# EAGLE design SolarPanelOptimizer (EAGLE 9.6.2)
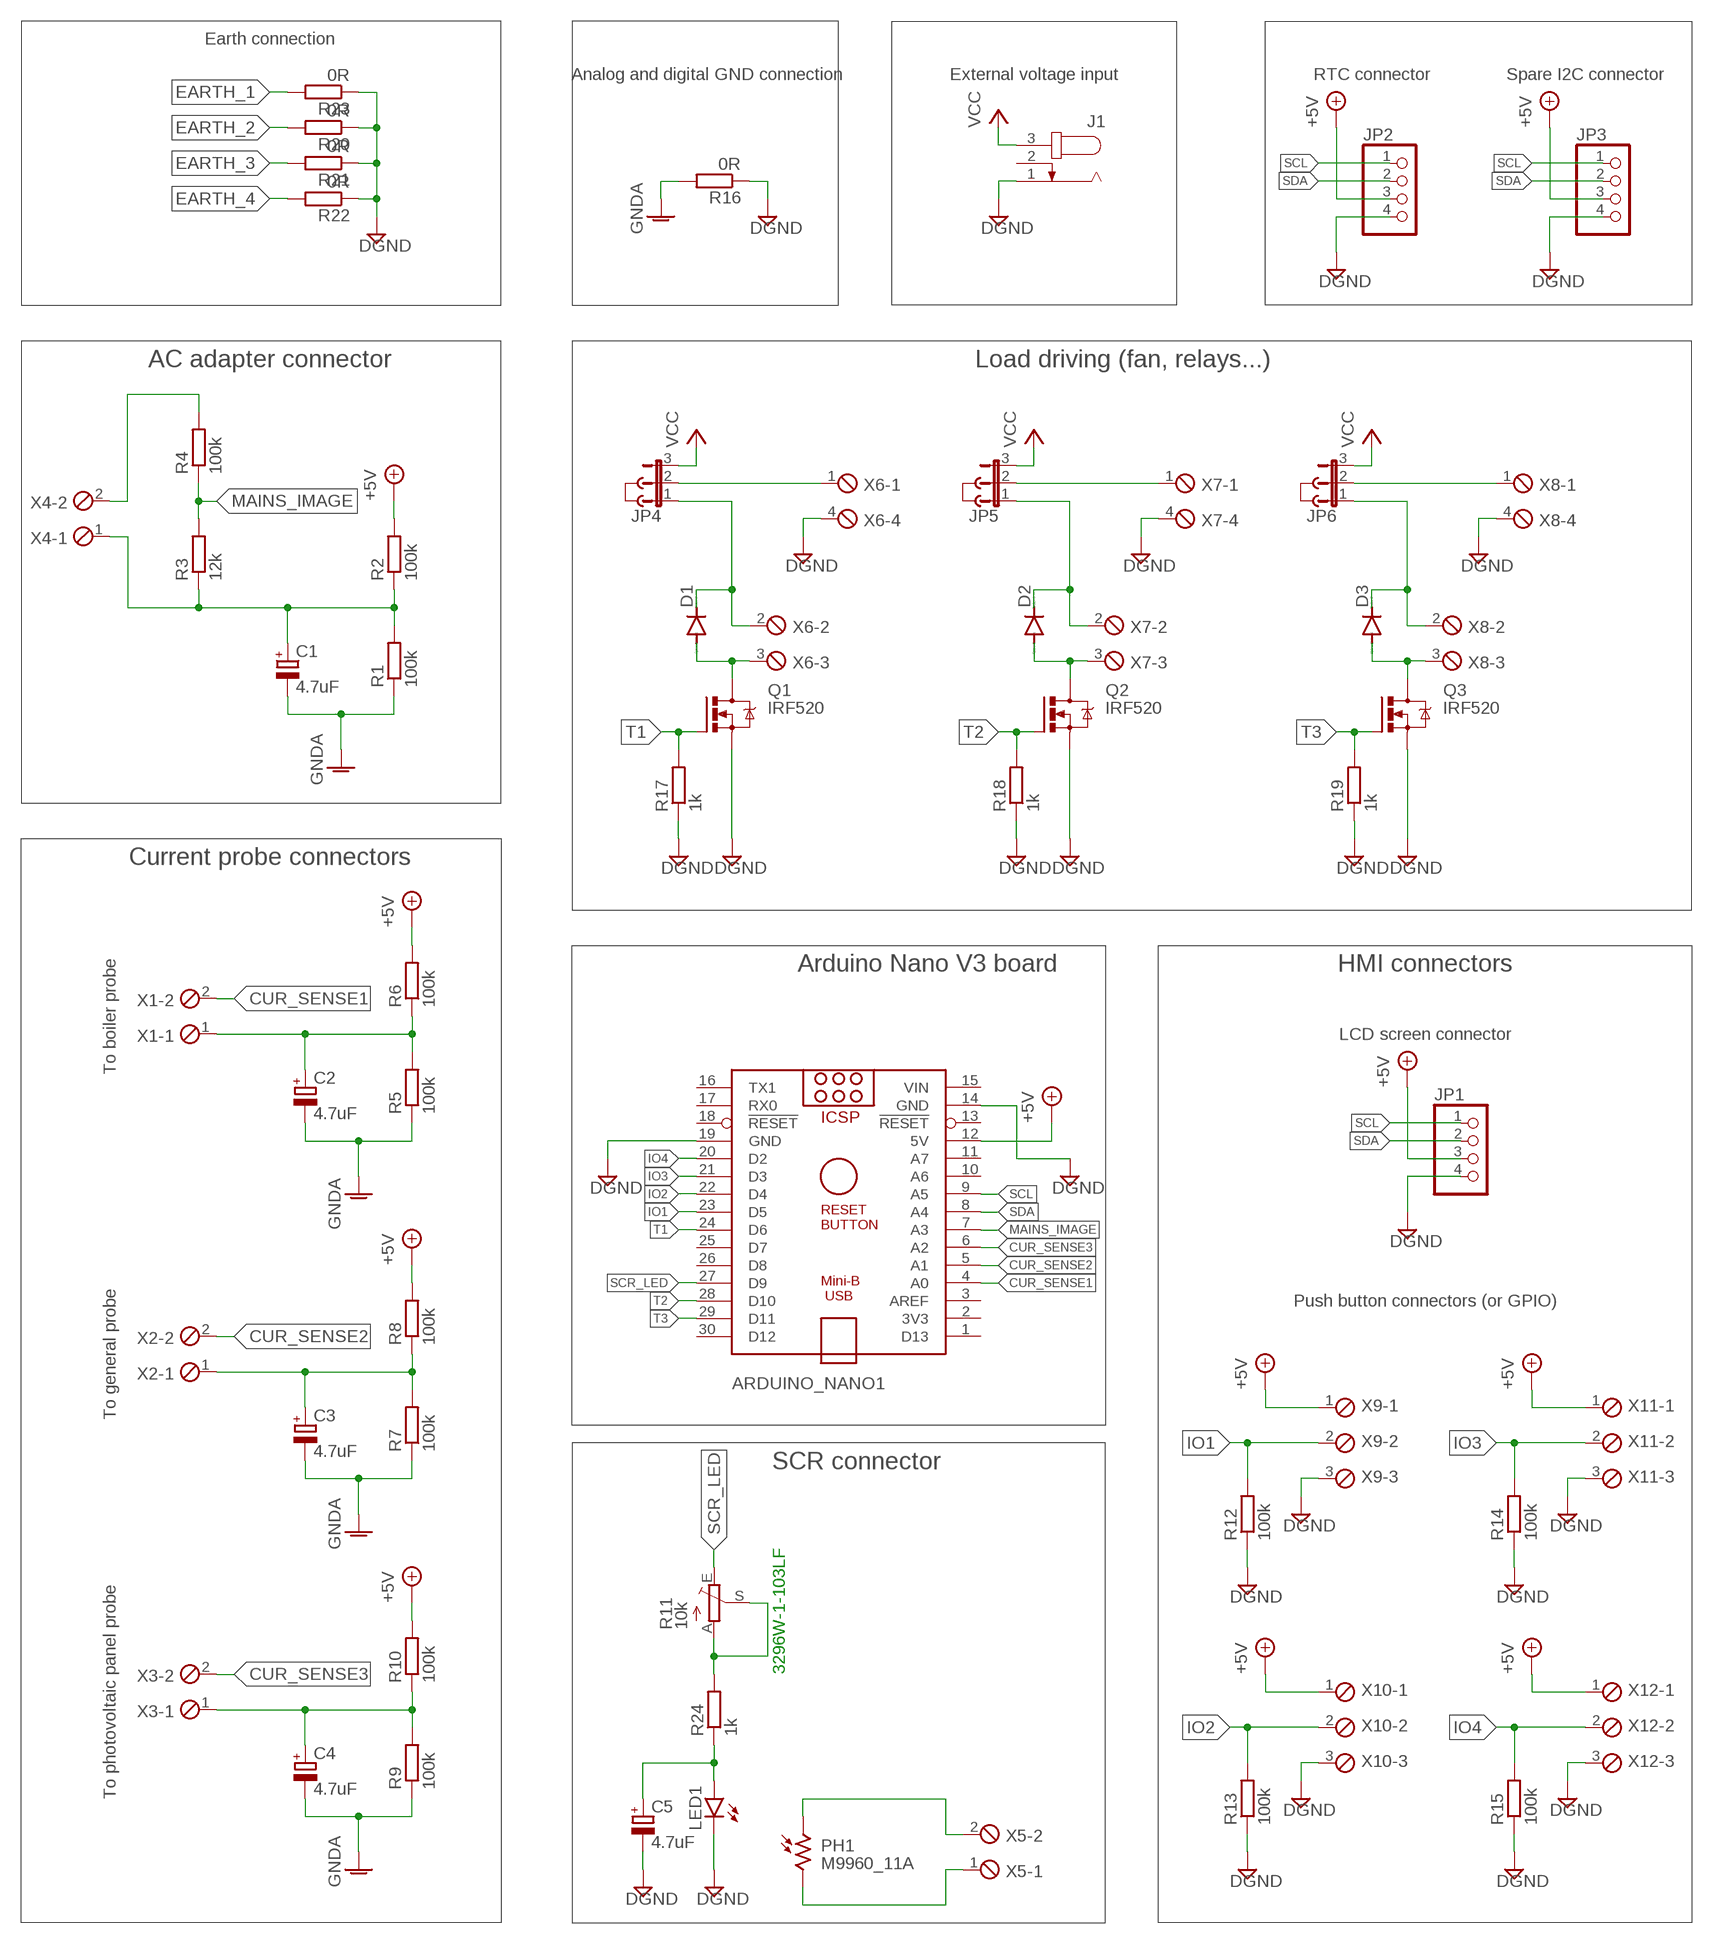
[diagram p0: schematic, sheet 1]

## Parts
ARDUINO_NANO1  ARDUINO_NANO  [ARDUINO_NANO]
C1  4.7uF  CPOL-EUE2-5  [E2-5]
C2  4.7uF  CPOL-EUE2-5  [E2-5]
C3  4.7uF  CPOL-EUE2-5  [E2-5]
C4  4.7uF  CPOL-EUE2-5  [E2-5]
C5  4.7uF  CPOL-EUE2-5  [E2-5]
D1  DIODE-D-2.5  [D-2.5]
D2  DIODE-D-2.5  [D-2.5]
D3  DIODE-D-2.5  [D-2.5]
J1  JACK-PLUG0  [SPC4077]
J2  JUMPER  [JUMP]
J3  JUMPER  [JUMP]
J4  JUMPER  [JUMP]
JP1  PINHD-1X4  [1X04]
JP2  PINHD-1X4  [1X04]
JP3  PINHD-1X4  [1X04]
JP4  JP2E  [JP2]
JP5  JP2E  [JP2]
JP6  JP2E  [JP2]
LED1  LED3MM  [LED3MM]
PH1  M9960_11A  [M9960]
Q1  IRF520  [TO220BV]
Q2  IRF520  [TO220BV]
Q3  IRF520  [TO220BV]
R1  100k  R-EU_0204/2V  [0204V]
R2  100k  R-EU_0204/2V  [0204V]
R3  12k  R-EU_0204/2V  [0204V]
R4  100k  R-EU_0204/2V  [0204V]
R5  100k  R-EU_0204/2V  [0204V]
R6  100k  R-EU_0204/2V  [0204V]
R7  100k  R-EU_0204/2V  [0204V]
R8  100k  R-EU_0204/2V  [0204V]
R9  100k  R-EU_0204/2V  [0204V]
R10  100k  R-EU_0204/2V  [0204V]
R11  10k  TRIM_EU-RJ9W  [RJ9W]
R12  100k  R-EU_0204/2V  [0204V]
R13  100k  R-EU_0204/2V  [0204V]
R14  100k  R-EU_0204/2V  [0204V]
R15  100k  R-EU_0204/2V  [0204V]
R16  0R  R-EU_R0805  [R0805]
R17  1k  R-EU_0204/2V  [0204V]
R18  1k  R-EU_0204/2V  [0204V]
R19  1k  R-EU_0204/2V  [0204V]
R20  0R  R-EU_R0805  [R0805]
R21  0R  R-EU_R0805  [R0805]
R22  0R  R-EU_R0805  [R0805]
R23  0R  R-EU_R0805  [R0805]
R24  1k  R-EU_0204/2V  [0204V]
X1  MPT2-REAL  [2POL254-REAL]
X2  MPT2-REAL  [2POL254-REAL]
X3  MPT2-REAL  [2POL254-REAL]
X4  MPT2-REAL  [2POL254-REAL]
X5  MPT2-REAL  [2POL254-REAL]
X6  MPT4-REAL  [4POL254-REAL]
X7  MPT4-REAL  [4POL254-REAL]
X8  MPT4-REAL  [4POL254-REAL]
X9  MPT3-REAL  [3POL254-REAL]
X10  MPT3-REAL  [3POL254-REAL]
X11  MPT3-REAL  [3POL254-REAL]
X12  MPT3-REAL  [3POL254-REAL]

## Nets
CUR_SENSE1: ARDUINO_NANO1.4(A0) X1.2
CUR_SENSE2: ARDUINO_NANO1.5(A1) X2.2
CUR_SENSE3: ARDUINO_NANO1.6(A2) X3.2
DGND: ARDUINO_NANO1.14(GND) ARDUINO_NANO1.19(GND) C5.- J1.1 JP1.4 JP2.4 JP3.4 LED1.K(C) Q1.S Q2.S Q3.S R12.1 R13.1 R14.1 R15.1 R16.1 R17.1 R18.1 R19.1 R20.1 R21.1 R22.1 R23.1 X6.4 X7.4 X8.4 X9.3 X10.3 X11.3 X12.3
EARTH_1: R23.2
EARTH_2: R20.2
EARTH_3: R21.2
EARTH_4: R22.2
GNDA: C1.- C2.- C3.- C4.- R1.1 R5.1 R7.1 R9.1 R16.2
IO1: ARDUINO_NANO1.23(D5) R12.2 X9.2
IO2: ARDUINO_NANO1.22(D4) R13.2 X10.2
IO3: ARDUINO_NANO1.21(D3) R14.2 X11.2
IO4: ARDUINO_NANO1.20(D2) R15.2 X12.2
MAINS_IMAGE: ARDUINO_NANO1.7(A3) R3.2 R4.1
N$1: C1.+ R1.2 R2.1 R3.1 X4.1
N$2: C2.+ R5.2 R6.1 X1.1
N$3: C3.+ R7.2 R8.1 X2.1
N$4: C4.+ R9.2 R10.1 X3.1
N$5: R4.2 X4.2
N$6: PH1.1 X5.2
N$7: C5.+ LED1.A R24.1
N$8: PH1.2 X5.1
N$9: D2.A Q2.D X7.3
N$10: R11.A R11.S R24.2
N$15: JP4.2 X6.1
N$16: D1.A Q1.D X6.3
N$17: D1.C JP4.1 X6.2
N$19: D2.C JP5.1 X7.2
N$20: JP5.2 X7.1
N$21: D3.A Q3.D X8.3
N$22: D3.C JP6.1 X8.2
N$23: JP6.2 X8.1
SCL: ARDUINO_NANO1.9(A5) JP1.1 JP2.1 JP3.1
SCR_LED: ARDUINO_NANO1.27(D9) R11.E
SDA: ARDUINO_NANO1.8(A4) JP1.2 JP2.2 JP3.2
T1: ARDUINO_NANO1.24(D6) Q1.G R17.2
T2: ARDUINO_NANO1.28(D10) Q2.G R18.2
T3: ARDUINO_NANO1.29(D11) Q3.G R19.2
VCC: J1.3 JP4.3 JP5.3 JP6.3
VDD: ARDUINO_NANO1.12(5V) JP1.3 JP2.3 JP3.3 R2.2 R6.2 R8.2 R10.2 X9.1 X10.1 X11.1 X12.1 ; supply symbol labelled +5V
Unconnected: ARDUINO_NANO1.1(D13) ARDUINO_NANO1.2(3V3) ARDUINO_NANO1.3(AREF) ARDUINO_NANO1.10(A6) ARDUINO_NANO1.11(A7) ARDUINO_NANO1.13(!RESET) ARDUINO_NANO1.16(TX1) ARDUINO_NANO1.17(RX0) ARDUINO_NANO1.18(!RESET) ARDUINO_NANO1.25(D7) ARDUINO_NANO1.26(D8) ARDUINO_NANO1.30(D12) J1.2

## Notes on the sheet
- Earth connection
- Analog and digital GND connection | External voltage input | RTC connector | Spare I2C connector
- AC adapter connector | Load driving (fan, relays...)
- Current probe connectors
- Arduino Nano V3 board | HMI connectors
- To boiler probe
- LCD screen connector
- Push button connectors (or GPIO)
- To general probe
- SCR connector
- 3296W-1-103LF
- To photovoltaic panel probe

## Power pins joined to a net without a drawn wire
VIN: ARDUINO_NANO1.15(VIN)

## Library data of the parts
ARDUINO_NANO1 = ArduinoNanoV30:ARDUINO_NANO: Arduino Nano V3.0 Overview: The Arduino Nano is a small, complete, and breadboard-friendly board based on the ATmega328 (Arduino Nano 3.x) or ATmega168 (Arduino Nano 2.x). It has more or less the same functionality of the Arduino Duemilanove, but in a different package. It lacks only a DC power jack, and works with a Mini-B USB cable instead of a standard one. The Nano was designed and is being produced by Gravitech. Specifications: Microcontroller Atmel ATmega168 or ATmega328 Operating Voltage (logic level) 5 V Input Voltage (recommended) 7-12 V Input Voltage (limits) 6-20 V Digital I/O Pins 14 (of which 6 provide PWM output) Analog Input Pins 8 DC Current per I/O Pin 40 mA Flash Memory 16 KB (ATmega168) or 32 KB (ATmega328) of which 2 KB used by bootloader SRAM 1 KB (ATmega168) or 2 KB (ATmega328) EEPROM 512 bytes (ATmega168) or 1 KB (ATmega328) Clock Speed 16 MHz Dimensions 0.73" x 1.70" Length 45 mm Width 18 mm Weigth 5 g Power: The Arduino Nano can be powered via the Mini-B USB connection, 6-20V unregulated external power supply (pin 30), or 5V regulated external power supply (pin 27). The power source is automatically selected to the highest voltage source. Memory: The ATmega168 has 16 KB of flash memory for storing code (of which 2 KB is used for the bootloader); the ATmega328 has 32 KB, (also with 2 KB used for the bootloader). The ATmega168 has 1 KB of SRAM and 512 bytes of EEPROM (which can be read and written with the EEPROM library); the ATmega328 has 2 KB of SRAM and 1 KB of EEPROM. Input and Output: Each of the 14 digital pins on the Nano can be used as an input or output, using pinMode(), digitalWrite(), and digitalRead() functions. They operate at 5 volts. Each pin can provide or receive a maximum of 40 mA and has an internal pull-up resistor (disconnected by default) of 20-50 kOhms. In addition, some pins have specialized functions. Visit Arduino - ArduinoBoardNano <https://www.arduino.cc/en/Main/ArduinoBoardNano>
C1-C5 = rcl:CPOL-EU: POLARIZED CAPACITOR, European symbol; SPICEPREFIX: C
D1-D3 = diode:DIODE-: DIODE
J1 = con-jack:JACK-PLUG: DC POWER JACK Power Jack, DC, Right Angle, Through Hole, Rated 5A at 16VDC, PC Terminals Distributor: Farnell (www.Farnell.de) Drawing: 84N1161.pdf / 84N1162.pdf Manufacturer: SPC Technology (www.spctechnology.com) Type: SPC4077 / SPC 4078; OC_FARNELL: unknown; OC_NEWARK: unknown
J2-J4 = jumper:JUMPER: JUMPER header
JP1-JP3 = pinhead:PINHD-1X4: PIN HEADER
JP4-JP6 = jumper:JP2E: JUMPER
LED1 = led:LED: LED OSRAM: - CHIPLED LG R971, LG N971, LY N971, LG Q971, LY Q971, LO R971, LY R971 LH N974, LH R974 LS Q976, LO Q976, LY Q976 LO Q996 - Hyper CHIPLED LW Q18S LB Q993, LB Q99A, LB R99A - SideLED LS A670, LO A670, LY A670, LG A670, LP A670 LB A673, LV A673, LT A673, LW A673 LH A674 LY A675 LS A676, LA A676, LO A676, LY A676, LW A676 LS A679, LY A679, LG A679 - Hyper Micro SIDELED® LS Y876, LA Y876, LO Y876, LY Y876 LT Y87S - SmartLED LW L88C, LW L88S LB L89C, LB L89S, LG L890 LS L89K, LO L89K, LY L89K LS L896, LA L896, LO L896, LY L896 - TOPLED LS T670, LO T670, LY T670, LG T670, LP T670 LSG T670, LSP T670, LSY T670, LOP T670, LYG T670 LG T671, LOG T671, LSG T671 LB T673, LV T673, LT T673, LW T673 LH T674 LS T676, LA T676, LO T676, LY T676, LB T676, LH T676, LSB T676, LW T676 LB T67C, LV T67C, LT T67C, LS T67K, LO T67K, LY T67K, LW E67C LS E67B, LA E67B, LO E67B, LY E67B, LB E67C, LV E67C, LT E67C LW T67C LS T679, LY T679, LG T679 LS T770, LO T770, LY T770, LG T770, LP T770 LB T773, LV T773, LT T773, LW T773 LH T774 LS E675, LA E675, LY E675, LS T675 LS T776, LA T776, LO T776, LY T776, LB T776 LHGB T686 LT T68C, LB T68C - Hyper Mini TOPLED® LB M676 - Mini TOPLED Santana® LG M470 LS M47K, LO M47K, LY M47K Source: http://www.osram.convergy.de LUXEON: - LUMILED® LXK2-PW12-R00, LXK2-PW12-S00, LXK2-PW14-U00, LXK2-PW14-V00 LXK2-PM12-R00, LXK2-PM12-S00, LXK2-PM14-U00 LXK2-PE12-Q00, LXK2-PE12-R00, LXK2-PE12-S00, LXK2-PE14-T00, LXK2-PE14-U00 LXK2-PB12-K00, LXK2-PB12-L00, LXK2-PB12-M00, LXK2-PB14-N00, LXK2-PB14-P00, LXK2-PB14-Q00 LXK2-PR12-L00, LXK2-PR12-M00, LXK2-PR14-Q00, LXK2-PR14-R00 LXK2-PD12-Q00, LXK2-PD12-R00, LXK2-PD12-S00 LXK2-PH12-R00, LXK2-PH12-S00 LXK2-PL12-P00, LXK2-PL12-Q00, LXK2-PL12-R00 Source: www.luxeon.com KINGBRIGHT: KA-3528ASYC Source: www.kingbright.com
PH1 = photo-elements:M9960_11: Photo Sensor Beacon Light, Photometer Applications Source: http://optoelectronics.perkinelmer.com/content/Datasheets/DTS_M9960.pdf
Q1-Q3 = transistor-power:IRF520: HEXFET Power MOSFET
R1-R10 R12-R24 = rcl:R-EU_: RESISTOR, European symbol; SPICEPREFIX: R
R11 = pot:TRIM_EU-: POTENTIOMETER
X1-X5 = con-phoenix-254_custom:MPT2: PHOENIX CONNECTOR
X6-X8 = con-phoenix-254_custom:MPT4: PHOENIX CONNECTOR
X9-X12 = con-phoenix-254_custom:MPT3: PHOENIX CONNECTOR

## Board
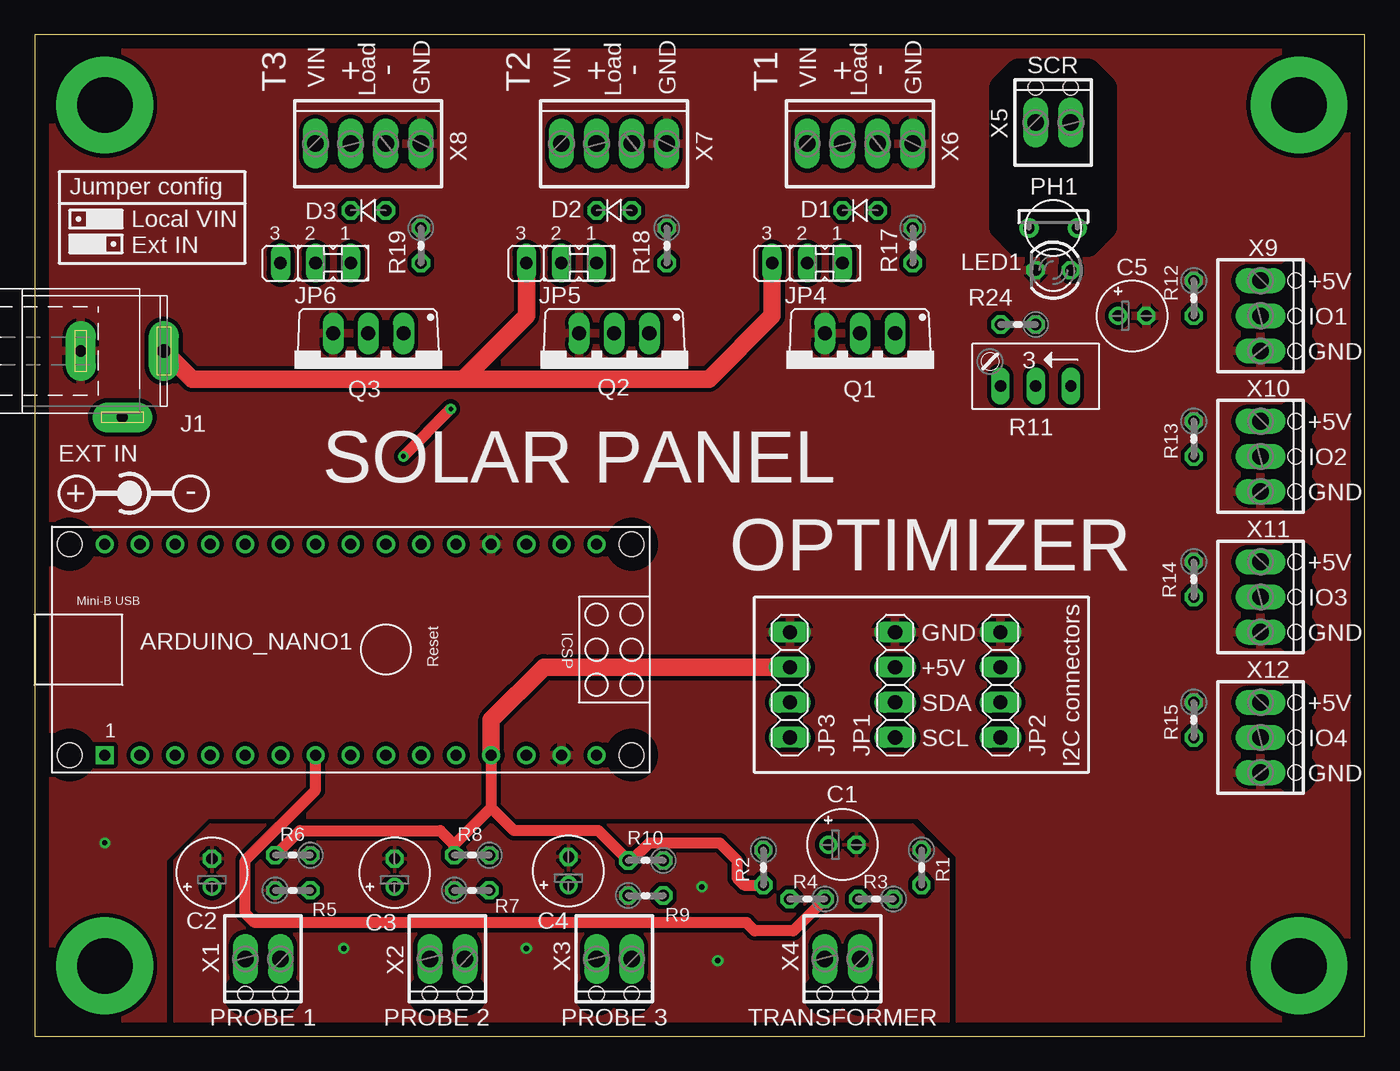
[diagram p1: board, top side]
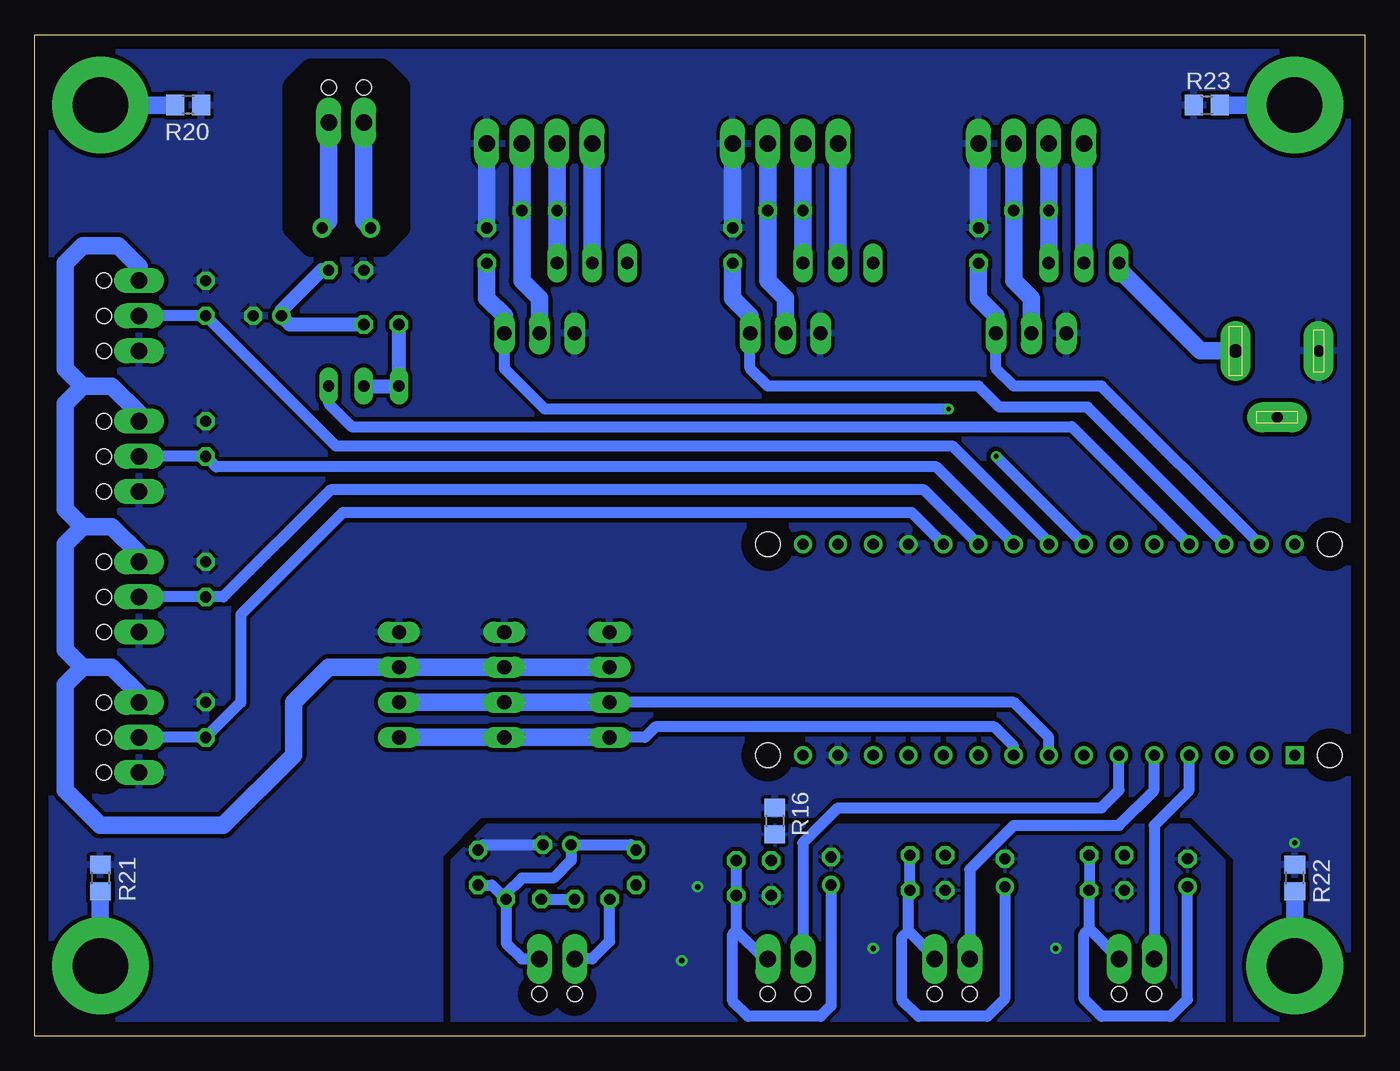
[diagram p2: board, bottom side, seen from below]

Size 96.2 x 72.4 mm. Coordinates in mm from the lower left corner, seen from the top.
Outline: 0,0 96.2,0 96.2,72.4 0,72.4 0,0
Copper layers (1*16): Top 0.035mm / dielectric 1.5mm / Bottom 0.035mm
Design rules "default": minimum track width 6mil, minimum drill 0.35mm, track to track 6mil, track to pad 6mil, pad to pad 6mil, via to via 6mil, smd to smd 6mil, copper to edge 40mil, drill to drill 6mil, minimum pad ring 10mil, minimum via ring 8mil, stop-mask expansion 4mil, vias tented up to drill 0mil, thermal gap 10mil
tRestrict: 8 lines
bRestrict: 8 lines

### Footprints (pad centres in the part's own frame; a part is rotated, then mirrored left to right if it is on the bottom)
ARDUINO_NANO = drill 0.8 square: 1 -20.32,-7.62 | drill 0.8: 2 -17.78,-7.62; 3 -15.24,-7.62; 4 -12.7,-7.62; 5 -10.16,-7.62; 6 -7.62,-7.62; 7 -5.08,-7.62; 8 -2.54,-7.62; 9 0,-7.62; 10 2.54,-7.62; 11 5.08,-7.62; 12 7.62,-7.62; 13 10.16,-7.62; 14 12.7,-7.62; 15 15.24,-7.62; 16 15.24,7.62; 17 12.7,7.62; 18 10.16,7.62; 19 7.62,7.62; 20 5.08,7.62; 21 2.54,7.62; 22 0,7.62; 23 -2.54,7.62; 24 -5.08,7.62; 25 -7.62,7.62; 26 -10.16,7.62; 27 -12.7,7.62; 28 -15.24,7.62; 29 -17.78,7.62; 30 -20.32,7.62 | hole 1.778: -22.86,-7.62; -22.86,7.62; 17.78,7.62; 17.78,-7.62
E2-5 = drill 0.813 pad 1.27: + -1.016,0 | drill 0.813 pad 1.27 octagon: - 1.016,0
D-2.5 = drill 0.813 octagon: A 1.27,0; C -1.27,0
SPC4077 = drill 0.8 pad 2.184 long: 1 -3,0; 2 0,-4.8 | drill 1 pad 2.184 long: 3 3,0
1X04 = drill 1.016 long: 1 -3.81,0; 2 -1.27,0; 3 1.27,0; 4 3.81,0
JP2 = drill 0.914 long: 1 -2.54,0; 2 0,0; 3 2.54,0
LED3MM = drill 0.813 octagon: A -1.27,0; K 1.27,0
M9960 = drill 0.8 pad 1.4: 1 -1.75,0; 2 1.75,0
TO220BV = drill 1.016 long: D 0,-2.54; G -2.54,-2.54; S 2.54,-2.54
0204V = drill 0.813 octagon: 1 -1.27,0; 2 1.27,0
RJ9W = drill 0.813 long: A 2.54,0.635; E -2.54,0.635; S 0,0.635
R0805 = smd 1.3 x 1.5: 1 -0.95,0; 2 0.95,0
2POL254-REAL = drill 1.2 long: 1 -1.27,0; 2 1.27,0 | hole 1.1: -1.27,2.54; 1.27,2.54
4POL254-REAL = drill 1.2 long: 1 -3.81,0; 2 -1.27,0; 3 1.27,0; 4 3.81,0
3POL254-REAL = drill 1.2 long: 1 -2.54,0; 2 0,0; 3 2.54,0 | hole 1.1: -2.54,2.54; 0,2.54; 2.54,2.54

### Placement (x,y rotation side)
ARDUINO_NANO1  25.4,27.94 0 top
C1  58.42,13.84 0 top
C2  12.83,11.81 90 top
C3  26.04,11.81 90 top
C4  38.61,11.94 90 top
C5  79.38,52.07 0 top
D1  59.69,59.69 0 top
D2  41.91,59.69 0 top
D3  24.13,59.69 0 top
J1  6.35,49.53 0 top
J2  39.37,55.88 90 top
J3  57.15,55.88 90 top
J4  21.59,55.88 90 top
JP1  62.23,25.4 90 top
JP2  69.85,25.4 90 top
JP3  54.61,25.4 90 top
JP4  55.88,55.88 180 top
JP5  38.1,55.88 180 top
JP6  20.32,55.88 180 top
LED1  73.66,55.37 180 top
PH1  73.66,58.42 180 top
Q1  59.69,48.26 180 top
Q2  41.91,48.26 180 top
Q3  24.13,48.26 180 top
R1  64.14,12.19 270 top
R2  52.7,12.19 270 top
R3  60.83,9.91 180 top
R4  55.88,9.91 180 top
R5  18.67,10.54 0 top
R6  18.67,13.08 180 top
R7  31.62,10.54 0 top
R8  31.62,13.08 180 top
R9  44.2,10.16 0 top
R10  44.2,12.7 180 top
R11  72.39,47.62 180 top
R12  83.82,53.34 270 top
R13  83.82,43.18 270 top
R14  83.82,33.02 270 top
R15  83.82,22.86 270 top
R16  42.67,15.55 270 bottom
R17  63.5,57.15 270 top
R18  45.72,57.15 270 top
R19  27.94,57.15 270 top
R20  85.09,67.31 180 bottom
R21  91.44,11.43 270 bottom
R22  5.08,11.43 270 bottom
R23  11.43,67.31 0 bottom
R24  71.12,51.44 180 top
X1  16.51,5.59 180 top
X2  29.84,5.59 180 top
X3  41.91,5.59 180 top
X4  58.42,5.59 180 top
X5  73.66,66.04 0 top
X6  59.69,64.52 0 top
X7  41.91,64.52 0 top
X8  24.13,64.52 0 top
X9  88.65,52.07 270 top
X10  88.65,41.91 270 top
X11  88.65,31.75 270 top
X12  88.65,21.59 270 top

### Tracks (layer width: path | path; a pad name or v marks a point on that pad's centre or on a via)
CUR_SENSE1
  Bottom 0.813: ARDUINO_NANO1.4 12.7,17.78 15.24,15.24 X1.2
CUR_SENSE2
  Bottom 0.813: ARDUINO_NANO1.5 15.24,17.78 17.78,15.24 25.4,15.24 28.57,12.06 X2.2
CUR_SENSE3
  Bottom 0.813: ARDUINO_NANO1.6 17.78,17.78 19.05,16.51 38.1,16.51 40.64,13.97 X3.2
DGND  (via drill 0.35)
  Bottom 1.27: R19.1 X8.4 | R18.1 X7.4 | X6.4 R17.1
  other vias: 5.08,13.97
  pour Bottom (isolate 0.305): 9.27,-2.29 9.27,12.83 12.45,16 64.01,16 66.93,13.08 66.93,-2.41 106.68,-2.41 106.68,83.82 -5.08,83.82 -5.08,-2.29
  pour Top (isolate 0.305): -6.35,85.09 -6.35,-3.81 9.27,-3.81 9.27,12.83 12.45,16 64.01,16 66.93,13.08 66.93,-3.81 107.95,-3.81 107.95,85.09
EARTH_1  (via drill 4 pad 7)
  Bottom 1.27: R23.2 v5.08,67.31
EARTH_2  (via drill 4 pad 7)
  Bottom 1.27: R20.2 v91.44,67.31
EARTH_3  (via drill 4 pad 7)
  Bottom 1.27: R21.2 v91.44,5.08
EARTH_4  (via drill 4 pad 7)
  Bottom 1.27: R22.2 v5.08,5.08
GNDA  (via drill 0.4)
  Bottom 0.813: R1.1 63.75,13.84 C1.-
  other vias: 49.4,5.46 48.26,10.79 35.56,6.35 22.35,6.35
  pour Bottom (isolate 0.305): 10.16,-1.27 10.16,12.7 12.7,15.24 63.5,15.24 66.04,12.7 66.04,-1.27
  pour Top (isolate 0.305): 10.16,-0.51 10.16,12.7 12.7,15.24 63.5,15.24 66.04,12.7 66.04,-0.51
IO1
  Bottom 0.813: ARDUINO_NANO1.23 22.86,35.69 29.84,42.67 74.42,42.67 R12.2 X9.2
IO2
  Bottom 0.813: ARDUINO_NANO1.22 30.99,41.15 83.06,41.15 R13.2 X10.2
IO3
  Bottom 0.813: ARDUINO_NANO1.21 31.88,39.5 74.8,39.5 82.55,31.75 R14.2 X11.2
IO4
  Bottom 0.813: ARDUINO_NANO1.20 32.77,37.85 73.91,37.85 81.28,30.48 81.28,24.13 R15.2 X12.2
MAINS_IMAGE
  Top 0.813: R4.1 54.86,7.62 52.07,7.62 51.49,8.2 15.93,8.2 15.24,8.89 15.24,12.7 20.32,17.78 ARDUINO_NANO1.7
  Bottom 0.813: R3.2 R4.1
N$1
  Bottom 0.813: R3.1 62.1,6.73 60.96,5.59 X4.1 | R1.2 63.12,10.92 R3.1 | R2.1 53.09,13.84 C1.+ 57.4,12.7 58.67,11.43 60.96,11.43 62.1,10.29 R3.1
N$2
  Bottom 0.813: R6.1 R5.2 19.94,7.75 | X1.1 19.94,7.75 | C2.+ 12.83,2.67 14.07,1.42 19.05,1.42 20.32,2.69 20.32,7.37 19.94,7.75
N$3
  Bottom 0.813: 33.02,7.62 31.11,5.71 X2.1 | 33.02,7.62 33.02,10.41 R7.2 R8.1 | C3.+ 26.04,2.69 27.3,1.42 32.28,1.42 33.47,2.61 33.47,7.17 33.02,7.62
N$4
  Bottom 0.813: R10.1 R9.2 45.47,7.62 | C4.+ 38.61,2.18 39.37,1.42 44.6,1.42 45.72,2.54 45.72,7.37 45.47,7.62 | 45.47,7.62 43.43,5.59 X3.1
N$5
  Bottom 0.813: R4.2 54.61,6.86 55.88,5.59 X4.2
N$6
  Bottom 1.27: PH1.1 74.93,58.9 X5.2
N$7
  Bottom 1.016: R24.1 77.72,51.44 C5.+ 78.36,52.45 75.44,55.37 LED1.A
N$8
  Bottom 1.27: PH1.2 72.39,58.9 X5.1
N$9
  Bottom 1.27: Q2.D 41.91,53.34 43.18,54.61 D2.A X7.3
N$10
  Bottom 1.016: R11.S R11.A R24.2
N$15
  Bottom 1.27: JP4.2 X6.1
N$16
  Bottom 1.27: Q1.D 59.69,53.34 60.96,54.61 D1.A X6.3
N$17
  Bottom 1.27: JP4.1 D1.C X6.2
N$19
  Bottom 1.27: JP5.1 D2.C X7.2
N$20
  Bottom 1.27: JP5.2 X7.1
N$21
  Bottom 1.27: Q3.D 24.13,53.34 25.4,54.61 D3.A X8.3
N$22
  Bottom 1.27: JP6.1 D3.C X8.2
N$23
  Bottom 1.27: JP6.2 X8.1
SCL
  Bottom 0.813: ARDUINO_NANO1.9 25.4,20.95 26.8,22.35 51.31,22.35 52.07,21.59 JP3.1
  Bottom 1.27: JP3.1 JP1.1 JP2.1
SCR_LED
  Bottom 0.813: R11.E 74.93,45.72 73.28,44.07 21.21,44.07 ARDUINO_NANO1.27
SDA
  Bottom 0.813: ARDUINO_NANO1.8 22.86,21.59 25.4,24.13 JP3.2
  Bottom 1.27: JP2.2 JP1.2 JP3.2
T1  (via drill 0.35)
  Top 0.813: v30.1,45.34 v26.67,41.91
  Bottom 0.813: Q1.G 62.23,48.26 59.31,45.34 v30.1,45.34 | v26.67,41.91 ARDUINO_NANO1.24
  Bottom 1.27: Q1.G 62.23,52.07 63.5,53.34 R17.2
T2
  Bottom 0.813: ARDUINO_NANO1.28 20.07,45.47 26.42,45.47 27.94,46.99 43.18,46.99 44.45,48.26 Q2.G
  Bottom 1.27: R18.2 45.72,53.34 44.45,52.07 Q2.G
T3
  Bottom 0.813: ARDUINO_NANO1.29 19.05,46.99 25.4,46.99 26.67,48.26 Q3.G
  Bottom 1.27: Q3.G 26.67,52.07 27.94,53.34 R19.2
VCC
  Top 1.27: JP5.3 35.56,52.07 30.99,47.5 | 30.99,47.5 11.38,47.5 J1.3 | JP4.3 53.34,52.07 48.77,47.5 30.99,47.5
  Bottom 1.27: J1.3 11.89,49.53 17.78,55.42 JP6.3
VDD
  Top 0.813: ARDUINO_NANO1.12 33.02,16.51 | 33.02,16.51 30.35,13.84 | R6.2 19.18,14.86 29.34,14.86 30.35,13.84 | R8.2 30.35,13.84 | 33.02,16.51 34.67,14.86 40.77,14.86 R10.2 43.18,12.7 44.45,13.97 49.53,13.97 50.8,12.7 50.8,11.43 51.31,10.92 R2.2
  Top 1.27: ARDUINO_NANO1.12 33.02,22.86 36.83,26.67 JP3.3
  Bottom 1.27: 92.71,46.99 93.98,48.26 93.98,55.88 92.71,57.15 90.17,57.15 88.65,55.63 X9.1 | 92.71,46.99 93.98,45.72 93.98,38.1 92.71,36.83 | 92.71,36.83 93.98,35.56 93.98,27.94 92.71,26.67 | JP3.3 JP1.3 JP2.3 74.93,26.67 77.47,24.13 77.47,20.32 82.55,15.24 91.44,15.24 93.98,17.78 93.98,25.4 92.71,26.67 | X10.1 88.65,45.02 90.61,46.99 92.71,46.99 | X11.1 88.65,34.86 90.61,36.83 92.71,36.83 | X12.1 88.65,24.7 90.61,26.67 92.71,26.67

### Text on the board
tPlace: T3 | + | - | T2 | + | - | T1 | + | - | SCR | VIN | VIN | VIN | Load | GND | Load | GND | Load | GND | Jumper config | Local VIN / Ext IN | +5V | IO1 | GND | +5V | EXT IN | SOLAR PANEL | IO2 | + | - | GND | OPTIMIZER | +5V | IO3 | I2C connectors | GND | GND | +5V | SDA | +5V | SCL | IO4 | GND | PROBE 1 | PROBE 2 | PROBE 3 | TRANSFORMER